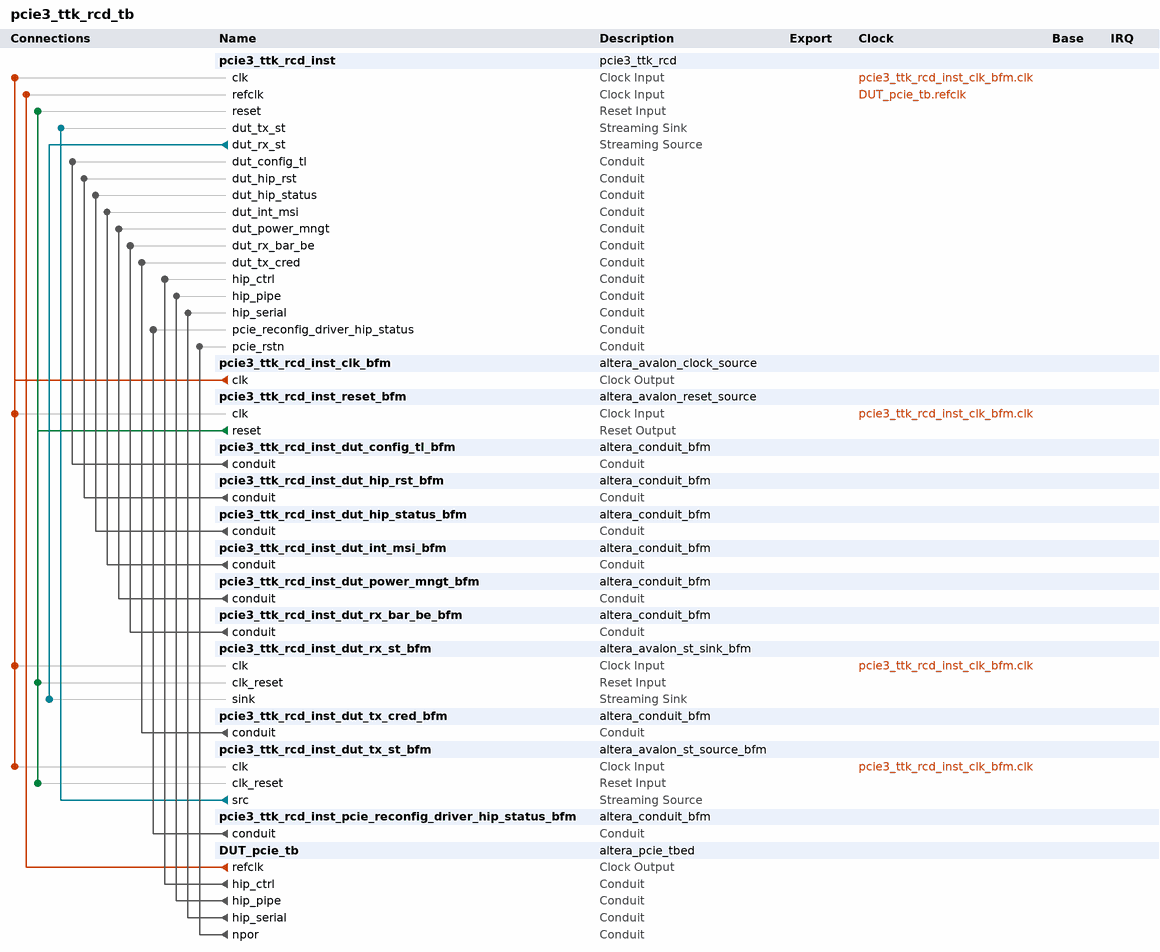
[diagram p0: system contents]
# Platform Designer (Qsys) system pcie3_ttk_rcd_tb, Stratix V 5SGSMD5K2F40I3L
# Parameters at their usual value, and those the tool derives, are not listed.
package require -exact qsys 15.1
create_system pcie3_ttk_rcd_tb
set_project_property DEVICE_FAMILY {Stratix V}
set_project_property DEVICE 5SGSMD5K2F40I3L

add_instance pcie3_ttk_rcd_inst pcie3_ttk_rcd 1.0

add_instance pcie3_ttk_rcd_inst_clk_bfm altera_avalon_clock_source 15.1

add_instance pcie3_ttk_rcd_inst_reset_bfm altera_avalon_reset_source 15.1
set_instance_parameter_value pcie3_ttk_rcd_inst_reset_bfm ASSERT_HIGH_RESET 0
set_instance_parameter_value pcie3_ttk_rcd_inst_reset_bfm INITIAL_RESET_CYCLES 50

add_instance pcie3_ttk_rcd_inst_dut_config_tl_bfm altera_conduit_bfm 15.1
set_instance_parameter_value pcie3_ttk_rcd_inst_dut_config_tl_bfm CLOCKED_SIGNAL false
set_instance_parameter_value pcie3_ttk_rcd_inst_dut_config_tl_bfm ENABLE_RESET false
set_instance_parameter_value pcie3_ttk_rcd_inst_dut_config_tl_bfm SIGNAL_DIRECTIONS output,input,input,input,output,output
set_instance_parameter_value pcie3_ttk_rcd_inst_dut_config_tl_bfm SIGNAL_ROLES hpg_ctrler,tl_cfg_add,tl_cfg_ctl,tl_cfg_sts,cpl_err,cpl_pending
set_instance_parameter_value pcie3_ttk_rcd_inst_dut_config_tl_bfm SIGNAL_WIDTHS 5,4,32,53,7,1

add_instance pcie3_ttk_rcd_inst_dut_hip_rst_bfm altera_conduit_bfm 15.1
set_instance_parameter_value pcie3_ttk_rcd_inst_dut_hip_rst_bfm CLOCKED_SIGNAL false
set_instance_parameter_value pcie3_ttk_rcd_inst_dut_hip_rst_bfm ENABLE_RESET false
set_instance_parameter_value pcie3_ttk_rcd_inst_dut_hip_rst_bfm SIGNAL_DIRECTIONS input,input,input,output,input
set_instance_parameter_value pcie3_ttk_rcd_inst_dut_hip_rst_bfm SIGNAL_ROLES reset_status,serdes_pll_locked,pld_clk_inuse,pld_core_ready,testin_zero
set_instance_parameter_value pcie3_ttk_rcd_inst_dut_hip_rst_bfm SIGNAL_WIDTHS 1,1,1,1,1

add_instance pcie3_ttk_rcd_inst_dut_hip_status_bfm altera_conduit_bfm 15.1
set_instance_parameter_value pcie3_ttk_rcd_inst_dut_hip_status_bfm CLOCKED_SIGNAL false
set_instance_parameter_value pcie3_ttk_rcd_inst_dut_hip_status_bfm ENABLE_RESET false
set_instance_parameter_value pcie3_ttk_rcd_inst_dut_hip_status_bfm SIGNAL_DIRECTIONS input,input,input,input,input,input,input,input,input,input,input,input,input,input,input,input,input
set_instance_parameter_value pcie3_ttk_rcd_inst_dut_hip_status_bfm SIGNAL_ROLES derr_cor_ext_rcv,derr_cor_ext_rpl,derr_rpl,dlup,dlup_exit,ev128ns,ev1us,hotrst_exit,int_status,l2_exit,lane_act,ltssmstate,rx_par_err,tx_par_err,cfg_par_err,ko_cpl_spc_header,ko_cpl_spc_data
set_instance_parameter_value pcie3_ttk_rcd_inst_dut_hip_status_bfm SIGNAL_WIDTHS 1,1,1,1,1,1,1,1,4,1,4,5,1,2,1,8,12

add_instance pcie3_ttk_rcd_inst_dut_int_msi_bfm altera_conduit_bfm 15.1
set_instance_parameter_value pcie3_ttk_rcd_inst_dut_int_msi_bfm CLOCKED_SIGNAL false
set_instance_parameter_value pcie3_ttk_rcd_inst_dut_int_msi_bfm ENABLE_RESET false
set_instance_parameter_value pcie3_ttk_rcd_inst_dut_int_msi_bfm SIGNAL_DIRECTIONS output,output,output,output,input,input
set_instance_parameter_value pcie3_ttk_rcd_inst_dut_int_msi_bfm SIGNAL_ROLES app_int_sts,app_msi_num,app_msi_req,app_msi_tc,app_int_ack,app_msi_ack
set_instance_parameter_value pcie3_ttk_rcd_inst_dut_int_msi_bfm SIGNAL_WIDTHS 1,5,1,3,1,1

add_instance pcie3_ttk_rcd_inst_dut_power_mngt_bfm altera_conduit_bfm 15.1
set_instance_parameter_value pcie3_ttk_rcd_inst_dut_power_mngt_bfm CLOCKED_SIGNAL false
set_instance_parameter_value pcie3_ttk_rcd_inst_dut_power_mngt_bfm ENABLE_RESET false
set_instance_parameter_value pcie3_ttk_rcd_inst_dut_power_mngt_bfm SIGNAL_DIRECTIONS output,output,output,output,input
set_instance_parameter_value pcie3_ttk_rcd_inst_dut_power_mngt_bfm SIGNAL_ROLES pm_auxpwr,pm_data,pme_to_cr,pm_event,pme_to_sr
set_instance_parameter_value pcie3_ttk_rcd_inst_dut_power_mngt_bfm SIGNAL_WIDTHS 1,10,1,1,1

add_instance pcie3_ttk_rcd_inst_dut_rx_bar_be_bfm altera_conduit_bfm 15.1
set_instance_parameter_value pcie3_ttk_rcd_inst_dut_rx_bar_be_bfm CLOCKED_SIGNAL false
set_instance_parameter_value pcie3_ttk_rcd_inst_dut_rx_bar_be_bfm ENABLE_RESET false
set_instance_parameter_value pcie3_ttk_rcd_inst_dut_rx_bar_be_bfm SIGNAL_DIRECTIONS input,input,output
set_instance_parameter_value pcie3_ttk_rcd_inst_dut_rx_bar_be_bfm SIGNAL_ROLES rx_st_bar,rx_st_be,rx_st_mask
set_instance_parameter_value pcie3_ttk_rcd_inst_dut_rx_bar_be_bfm SIGNAL_WIDTHS 8,32,1

add_instance pcie3_ttk_rcd_inst_dut_rx_st_bfm altera_avalon_st_sink_bfm 15.1
set_instance_parameter_value pcie3_ttk_rcd_inst_dut_rx_st_bfm ST_CHANNEL_W 1
set_instance_parameter_value pcie3_ttk_rcd_inst_dut_rx_st_bfm ST_ERROR_W 1
set_instance_parameter_value pcie3_ttk_rcd_inst_dut_rx_st_bfm ST_MAX_CHANNELS 0
set_instance_parameter_value pcie3_ttk_rcd_inst_dut_rx_st_bfm ST_NUMSYMBOLS 1
set_instance_parameter_value pcie3_ttk_rcd_inst_dut_rx_st_bfm ST_READY_LATENCY 3
set_instance_parameter_value pcie3_ttk_rcd_inst_dut_rx_st_bfm ST_SYMBOL_W 256
set_instance_parameter_value pcie3_ttk_rcd_inst_dut_rx_st_bfm USE_CHANNEL 0
set_instance_parameter_value pcie3_ttk_rcd_inst_dut_rx_st_bfm USE_EMPTY 1
set_instance_parameter_value pcie3_ttk_rcd_inst_dut_rx_st_bfm USE_ERROR 1
set_instance_parameter_value pcie3_ttk_rcd_inst_dut_rx_st_bfm USE_PACKET 1
set_instance_parameter_value pcie3_ttk_rcd_inst_dut_rx_st_bfm USE_READY 1
set_instance_parameter_value pcie3_ttk_rcd_inst_dut_rx_st_bfm USE_VALID 1
set_instance_parameter_value pcie3_ttk_rcd_inst_dut_rx_st_bfm VHDL_ID 0

add_instance pcie3_ttk_rcd_inst_dut_tx_cred_bfm altera_conduit_bfm 15.1
set_instance_parameter_value pcie3_ttk_rcd_inst_dut_tx_cred_bfm CLOCKED_SIGNAL false
set_instance_parameter_value pcie3_ttk_rcd_inst_dut_tx_cred_bfm ENABLE_RESET false
set_instance_parameter_value pcie3_ttk_rcd_inst_dut_tx_cred_bfm SIGNAL_DIRECTIONS input,input,input,input,input,input,input,input
set_instance_parameter_value pcie3_ttk_rcd_inst_dut_tx_cred_bfm SIGNAL_ROLES tx_cred_datafccp,tx_cred_datafcnp,tx_cred_datafcp,tx_cred_fchipcons,tx_cred_fcinfinite,tx_cred_hdrfccp,tx_cred_hdrfcnp,tx_cred_hdrfcp
set_instance_parameter_value pcie3_ttk_rcd_inst_dut_tx_cred_bfm SIGNAL_WIDTHS 12,12,12,6,6,8,8,8

add_instance pcie3_ttk_rcd_inst_dut_tx_st_bfm altera_avalon_st_source_bfm 15.1
set_instance_parameter_value pcie3_ttk_rcd_inst_dut_tx_st_bfm ST_CHANNEL_W 1
set_instance_parameter_value pcie3_ttk_rcd_inst_dut_tx_st_bfm ST_ERROR_W 1
set_instance_parameter_value pcie3_ttk_rcd_inst_dut_tx_st_bfm ST_MAX_CHANNELS 0
set_instance_parameter_value pcie3_ttk_rcd_inst_dut_tx_st_bfm ST_NUMSYMBOLS 1
set_instance_parameter_value pcie3_ttk_rcd_inst_dut_tx_st_bfm ST_READY_LATENCY 3
set_instance_parameter_value pcie3_ttk_rcd_inst_dut_tx_st_bfm ST_SYMBOL_W 256
set_instance_parameter_value pcie3_ttk_rcd_inst_dut_tx_st_bfm USE_CHANNEL 0
set_instance_parameter_value pcie3_ttk_rcd_inst_dut_tx_st_bfm USE_EMPTY 1
set_instance_parameter_value pcie3_ttk_rcd_inst_dut_tx_st_bfm USE_ERROR 1
set_instance_parameter_value pcie3_ttk_rcd_inst_dut_tx_st_bfm USE_PACKET 1
set_instance_parameter_value pcie3_ttk_rcd_inst_dut_tx_st_bfm USE_READY 1
set_instance_parameter_value pcie3_ttk_rcd_inst_dut_tx_st_bfm USE_VALID 1

add_instance pcie3_ttk_rcd_inst_pcie_reconfig_driver_hip_status_bfm altera_conduit_bfm 15.1
set_instance_parameter_value pcie3_ttk_rcd_inst_pcie_reconfig_driver_hip_status_bfm CLOCKED_SIGNAL false
set_instance_parameter_value pcie3_ttk_rcd_inst_pcie_reconfig_driver_hip_status_bfm ENABLE_RESET false
set_instance_parameter_value pcie3_ttk_rcd_inst_pcie_reconfig_driver_hip_status_bfm SIGNAL_DIRECTIONS output,output,output,output,output,output,output,output,output,output,output,output,output,output,output,output,output
set_instance_parameter_value pcie3_ttk_rcd_inst_pcie_reconfig_driver_hip_status_bfm SIGNAL_ROLES derr_cor_ext_rcv,derr_cor_ext_rpl,derr_rpl,dlup_exit,ev128ns,ev1us,hotrst_exit,int_status,l2_exit,lane_act,ltssmstate,dlup,rx_par_err,tx_par_err,cfg_par_err,ko_cpl_spc_header,ko_cpl_spc_data
set_instance_parameter_value pcie3_ttk_rcd_inst_pcie_reconfig_driver_hip_status_bfm SIGNAL_WIDTHS 1,1,1,1,1,1,1,4,1,4,5,1,1,2,1,8,12

add_instance DUT_pcie_tb altera_pcie_tbed 15.1
set_instance_parameter_value DUT_pcie_tb apps_type_hwtcl 1
set_instance_parameter_value DUT_pcie_tb deemphasis_enable_hwtcl false
set_instance_parameter_value DUT_pcie_tb ecrc_check_capable_hwtcl 0
set_instance_parameter_value DUT_pcie_tb ecrc_gen_capable_hwtcl 0
set_instance_parameter_value DUT_pcie_tb enable_pipe32_phyip_ser_driver_hwtcl 0
set_instance_parameter_value DUT_pcie_tb enable_pipe32_sim_hwtcl 1
set_instance_parameter_value DUT_pcie_tb enable_tl_only_sim_hwtcl 0
set_instance_parameter_value DUT_pcie_tb gen123_lane_rate_mode_hwtcl {Gen3 (8.0 Gbps)}
set_instance_parameter_value DUT_pcie_tb lane_mask_hwtcl x8
set_instance_parameter_value DUT_pcie_tb millisecond_cycle_count_hwtcl 248500
set_instance_parameter_value DUT_pcie_tb pld_clk_MHz 2500
set_instance_parameter_value DUT_pcie_tb pll_refclk_freq_hwtcl {100 MHz}
set_instance_parameter_value DUT_pcie_tb port_type_hwtcl {Native endpoint}
set_instance_parameter_value DUT_pcie_tb serial_sim_hwtcl 1
set_instance_parameter_value DUT_pcie_tb use_crc_forwarding_hwtcl 0
set_instance_parameter_value DUT_pcie_tb use_stratixv_tb_device false

# connections
add_connection DUT_pcie_tb.refclk pcie3_ttk_rcd_inst.refclk clock
add_connection pcie3_ttk_rcd_inst_clk_bfm.clk pcie3_ttk_rcd_inst.clk clock
add_connection pcie3_ttk_rcd_inst_clk_bfm.clk pcie3_ttk_rcd_inst_dut_rx_st_bfm.clk clock
add_connection pcie3_ttk_rcd_inst_clk_bfm.clk pcie3_ttk_rcd_inst_dut_tx_st_bfm.clk clock
add_connection pcie3_ttk_rcd_inst_clk_bfm.clk pcie3_ttk_rcd_inst_reset_bfm.clk clock
add_connection pcie3_ttk_rcd_inst_reset_bfm.reset pcie3_ttk_rcd_inst.reset reset
add_connection pcie3_ttk_rcd_inst_reset_bfm.reset pcie3_ttk_rcd_inst_dut_rx_st_bfm.clk_reset reset
add_connection pcie3_ttk_rcd_inst_reset_bfm.reset pcie3_ttk_rcd_inst_dut_tx_st_bfm.clk_reset reset
add_connection pcie3_ttk_rcd_inst.dut_rx_st pcie3_ttk_rcd_inst_dut_rx_st_bfm.sink avalon_streaming
add_connection pcie3_ttk_rcd_inst_dut_tx_st_bfm.src pcie3_ttk_rcd_inst.dut_tx_st avalon_streaming
add_connection DUT_pcie_tb.hip_ctrl pcie3_ttk_rcd_inst.hip_ctrl conduit
add_connection DUT_pcie_tb.hip_pipe pcie3_ttk_rcd_inst.hip_pipe conduit
add_connection DUT_pcie_tb.hip_serial pcie3_ttk_rcd_inst.hip_serial conduit
add_connection DUT_pcie_tb.npor pcie3_ttk_rcd_inst.pcie_rstn conduit
add_connection pcie3_ttk_rcd_inst_dut_config_tl_bfm.conduit pcie3_ttk_rcd_inst.dut_config_tl conduit
add_connection pcie3_ttk_rcd_inst_dut_hip_rst_bfm.conduit pcie3_ttk_rcd_inst.dut_hip_rst conduit
add_connection pcie3_ttk_rcd_inst_dut_hip_status_bfm.conduit pcie3_ttk_rcd_inst.dut_hip_status conduit
add_connection pcie3_ttk_rcd_inst_dut_int_msi_bfm.conduit pcie3_ttk_rcd_inst.dut_int_msi conduit
add_connection pcie3_ttk_rcd_inst_dut_power_mngt_bfm.conduit pcie3_ttk_rcd_inst.dut_power_mngt conduit
add_connection pcie3_ttk_rcd_inst_dut_rx_bar_be_bfm.conduit pcie3_ttk_rcd_inst.dut_rx_bar_be conduit
add_connection pcie3_ttk_rcd_inst_dut_tx_cred_bfm.conduit pcie3_ttk_rcd_inst.dut_tx_cred conduit
add_connection pcie3_ttk_rcd_inst_pcie_reconfig_driver_hip_status_bfm.conduit pcie3_ttk_rcd_inst.pcie_reconfig_driver_hip_status conduit

set_interconnect_requirement {$system} qsys_mm.clockCrossingAdapter HANDSHAKE
set_interconnect_requirement {$system} qsys_mm.enableEccProtection FALSE
set_interconnect_requirement {$system} qsys_mm.insertDefaultSlave FALSE
set_interconnect_requirement {$system} qsys_mm.maxAdditionalLatency 1

save_system pcie3_ttk_rcd_tb.qsys
